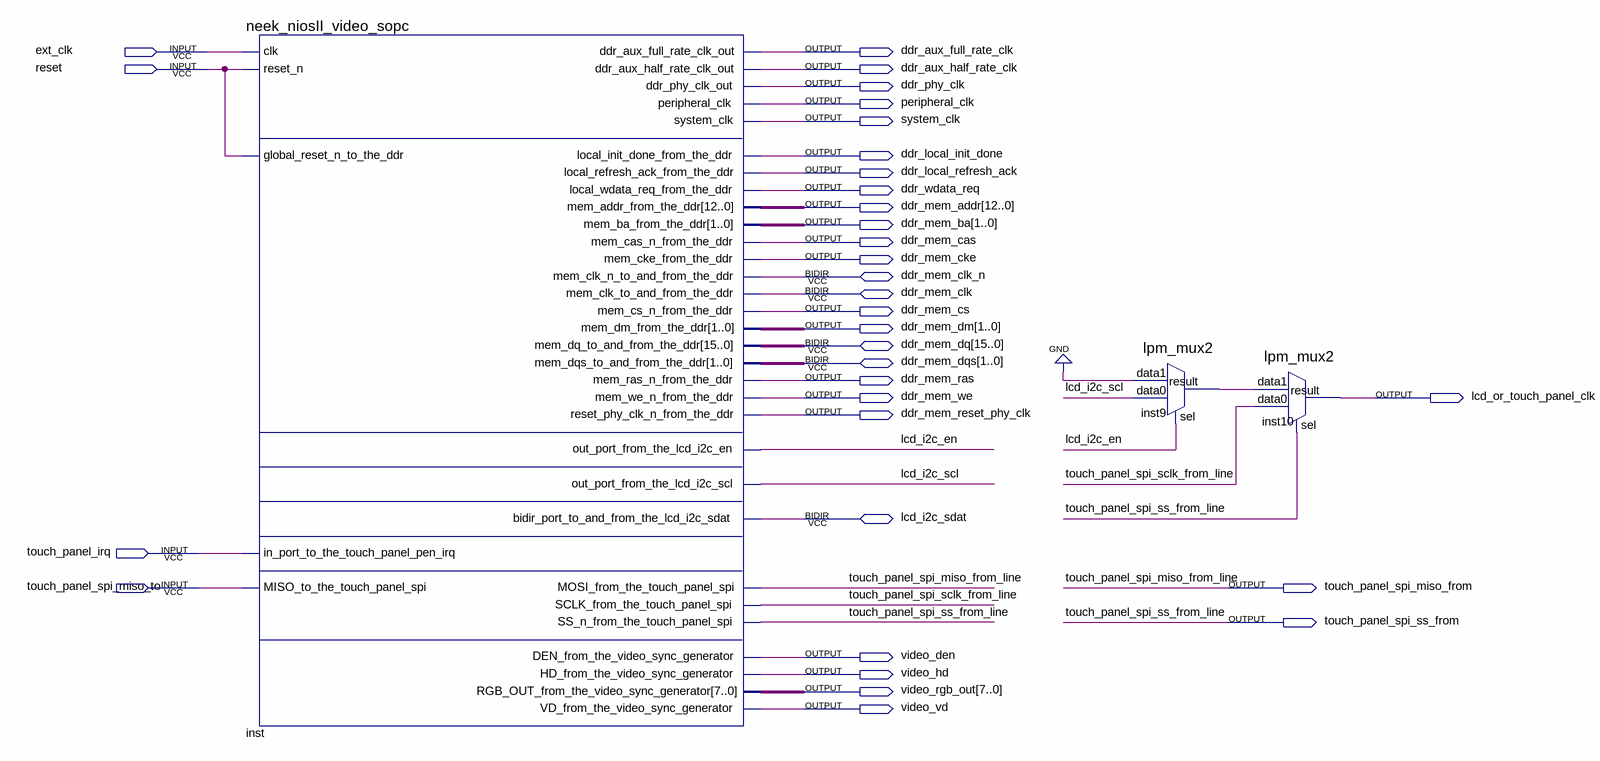
[diagram p0: schematic sheet]
// Quartus schematic neek_niosII_video_top.bdf as structural Verilog: 3 symbols, 33 pins
module neek_niosII_video_top (
  input  ext_clk,
  input  reset,
  input  touch_panel_irq,
  input  touch_panel_spi_miso_to,
  inout  ddr_mem_clk_n,
  inout  ddr_mem_clk,
  inout  [15:0] ddr_mem_dq,
  inout  [1:0] ddr_mem_dqs,
  inout  lcd_i2c_sdat,
  output ddr_aux_full_rate_clk,
  output ddr_aux_half_rate_clk,
  output ddr_phy_clk,
  output peripheral_clk,
  output system_clk,
  output ddr_local_init_done,
  output ddr_local_refresh_ack,
  output ddr_wdata_req,
  output [12:0] ddr_mem_addr,
  output [1:0] ddr_mem_ba,
  output ddr_mem_cas,
  output ddr_mem_cke,
  output ddr_mem_cs,
  output [1:0] ddr_mem_dm,
  output ddr_mem_ras,
  output ddr_mem_we,
  output lcd_or_touch_panel_clk,
  output ddr_mem_reset_phy_clk,
  output touch_panel_spi_miso_from,
  output touch_panel_spi_ss_from,
  output video_den,
  output video_hd,
  output [7:0] video_rgb_out,
  output video_vd
);

  wire inst9_result, lcd_i2c_en, lcd_i2c_scl, touch_panel_spi_sclk_from_line;

  neek_niosII_video_sopc inst (
    .clk(ext_clk), .reset_n(reset), .global_reset_n_to_the_ddr(reset),
    .in_port_to_the_touch_panel_pen_irq(touch_panel_irq),
    .MISO_to_the_touch_panel_spi(touch_panel_spi_miso_to), .ddr_aux_full_rate_clk_out(ddr_aux_full_rate_clk),
    .ddr_aux_half_rate_clk_out(ddr_aux_half_rate_clk), .ddr_phy_clk_out(ddr_phy_clk),
    .peripheral_clk(peripheral_clk), .system_clk(system_clk),
    .local_init_done_from_the_ddr(ddr_local_init_done),
    .local_refresh_ack_from_the_ddr(ddr_local_refresh_ack), .local_wdata_req_from_the_ddr(ddr_wdata_req),
    .mem_addr_from_the_ddr(ddr_mem_addr), .mem_ba_from_the_ddr(ddr_mem_ba),
    .mem_cas_n_from_the_ddr(ddr_mem_cas), .mem_cke_from_the_ddr(ddr_mem_cke),
    .mem_cs_n_from_the_ddr(ddr_mem_cs), .mem_dm_from_the_ddr(ddr_mem_dm),
    .mem_ras_n_from_the_ddr(ddr_mem_ras), .mem_we_n_from_the_ddr(ddr_mem_we),
    .reset_phy_clk_n_from_the_ddr(ddr_mem_reset_phy_clk), .out_port_from_the_lcd_i2c_en(lcd_i2c_en),
    .out_port_from_the_lcd_i2c_scl(lcd_i2c_scl), .MOSI_from_the_touch_panel_spi(touch_panel_spi_miso_from),
    .SCLK_from_the_touch_panel_spi(touch_panel_spi_sclk_from_line),
    .SS_n_from_the_touch_panel_spi(touch_panel_spi_ss_from), .DEN_from_the_video_sync_generator(video_den),
    .HD_from_the_video_sync_generator(video_hd), .RGB_OUT_from_the_video_sync_generator(video_rgb_out),
    .VD_from_the_video_sync_generator(video_vd), .mem_clk_n_to_and_from_the_ddr(ddr_mem_clk_n),
    .mem_clk_to_and_from_the_ddr(ddr_mem_clk), .mem_dq_to_and_from_the_ddr(ddr_mem_dq),
    .mem_dqs_to_and_from_the_ddr(ddr_mem_dqs), .bidir_port_to_and_from_the_lcd_i2c_sdat(lcd_i2c_sdat));
  lpm_mux2 inst9 (.data1(1'b0), .data0(lcd_i2c_scl), .sel(lcd_i2c_en), .result(inst9_result));
  lpm_mux2 inst10 (
    .data1(inst9_result), .data0(touch_panel_spi_sclk_from_line), .sel(touch_panel_spi_ss_from),
    .result(lcd_or_touch_panel_clk));

  // Other names for the same wires on the sheet: touch_panel_spi_miso_from_line = touch_panel_spi_miso_from;
  //   touch_panel_spi_ss_from_line = touch_panel_spi_ss_from
endmodule
